# Altium project silovaya_SAUVC26.PrjPcb
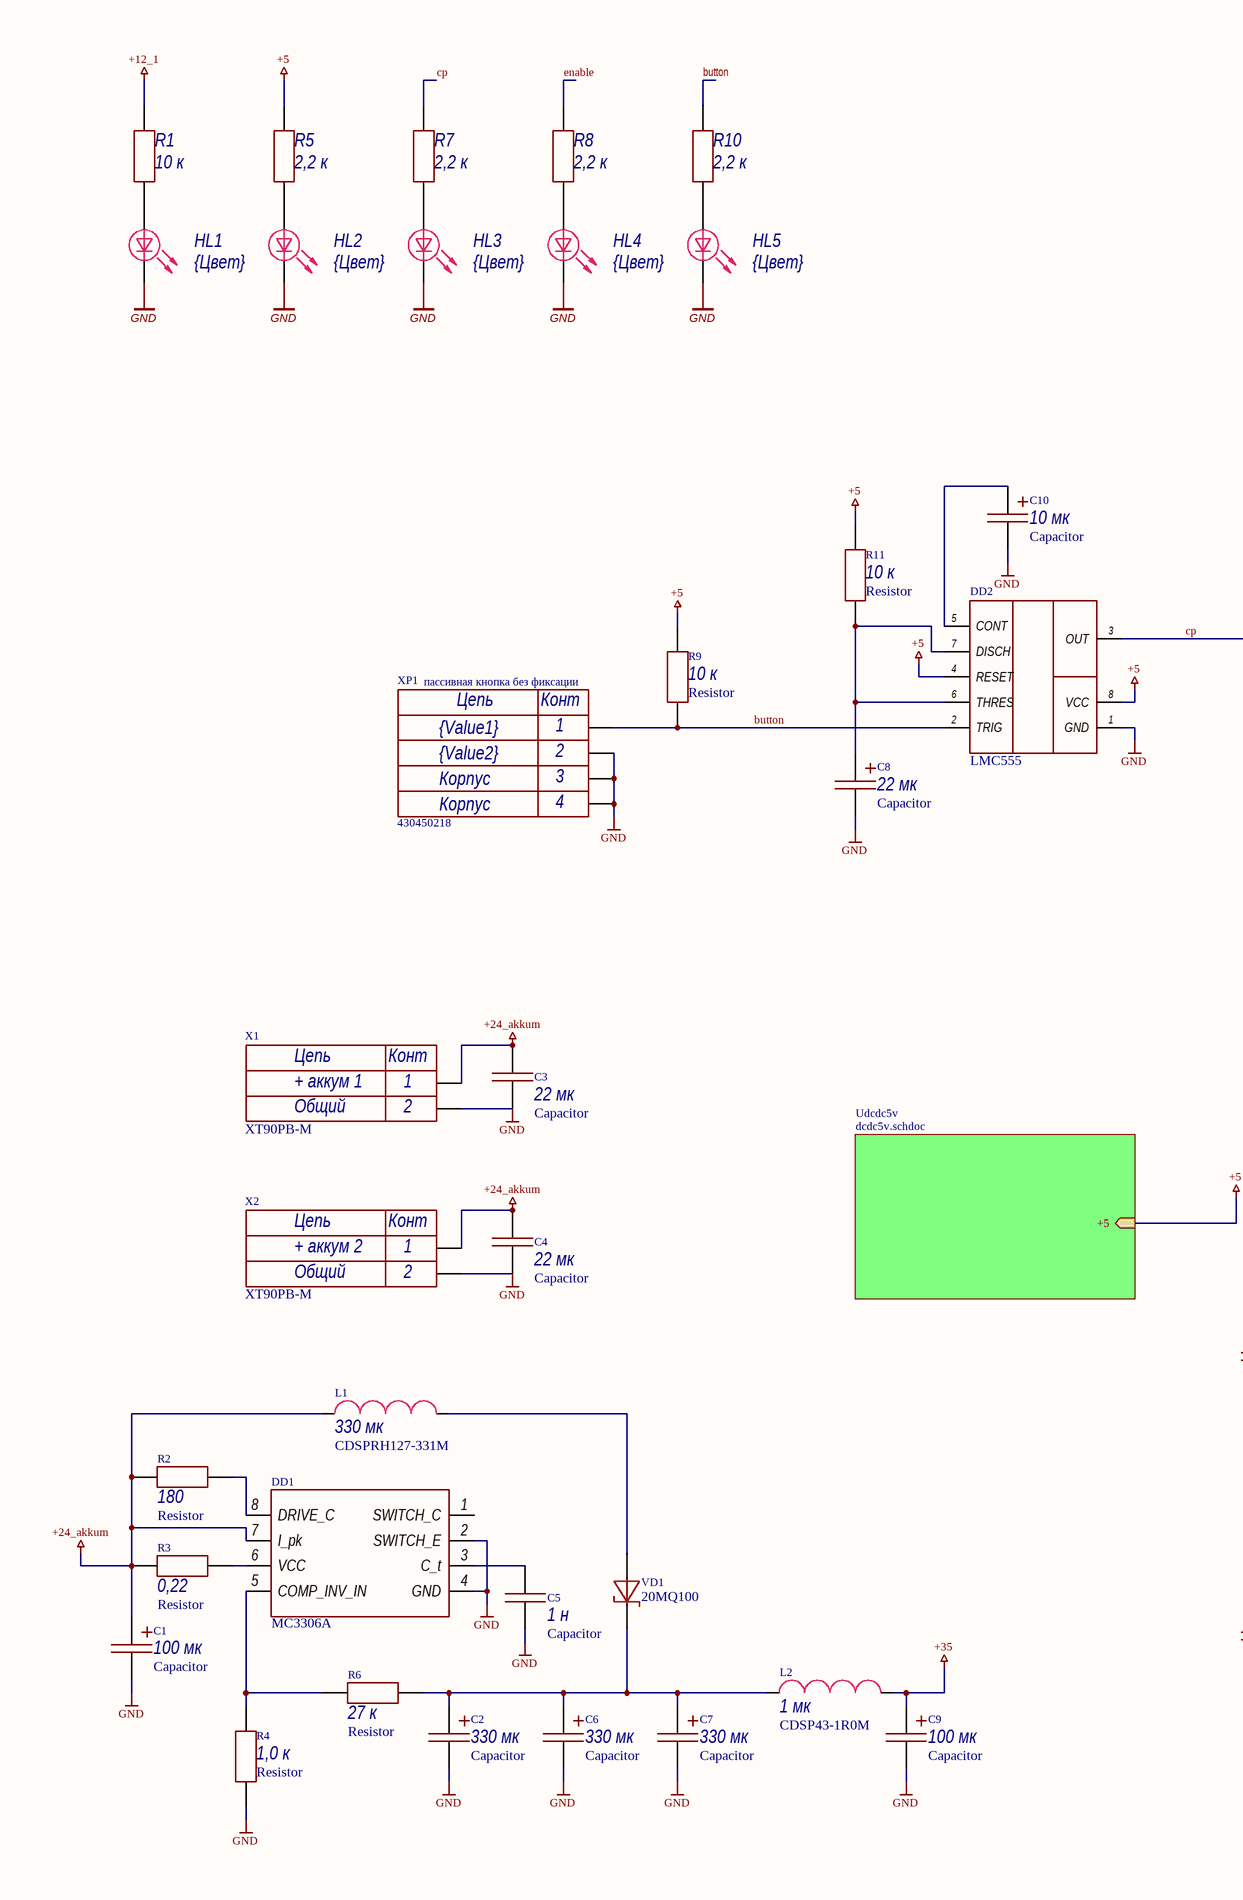
[diagram p0: Sheet1.SchDoc, left]
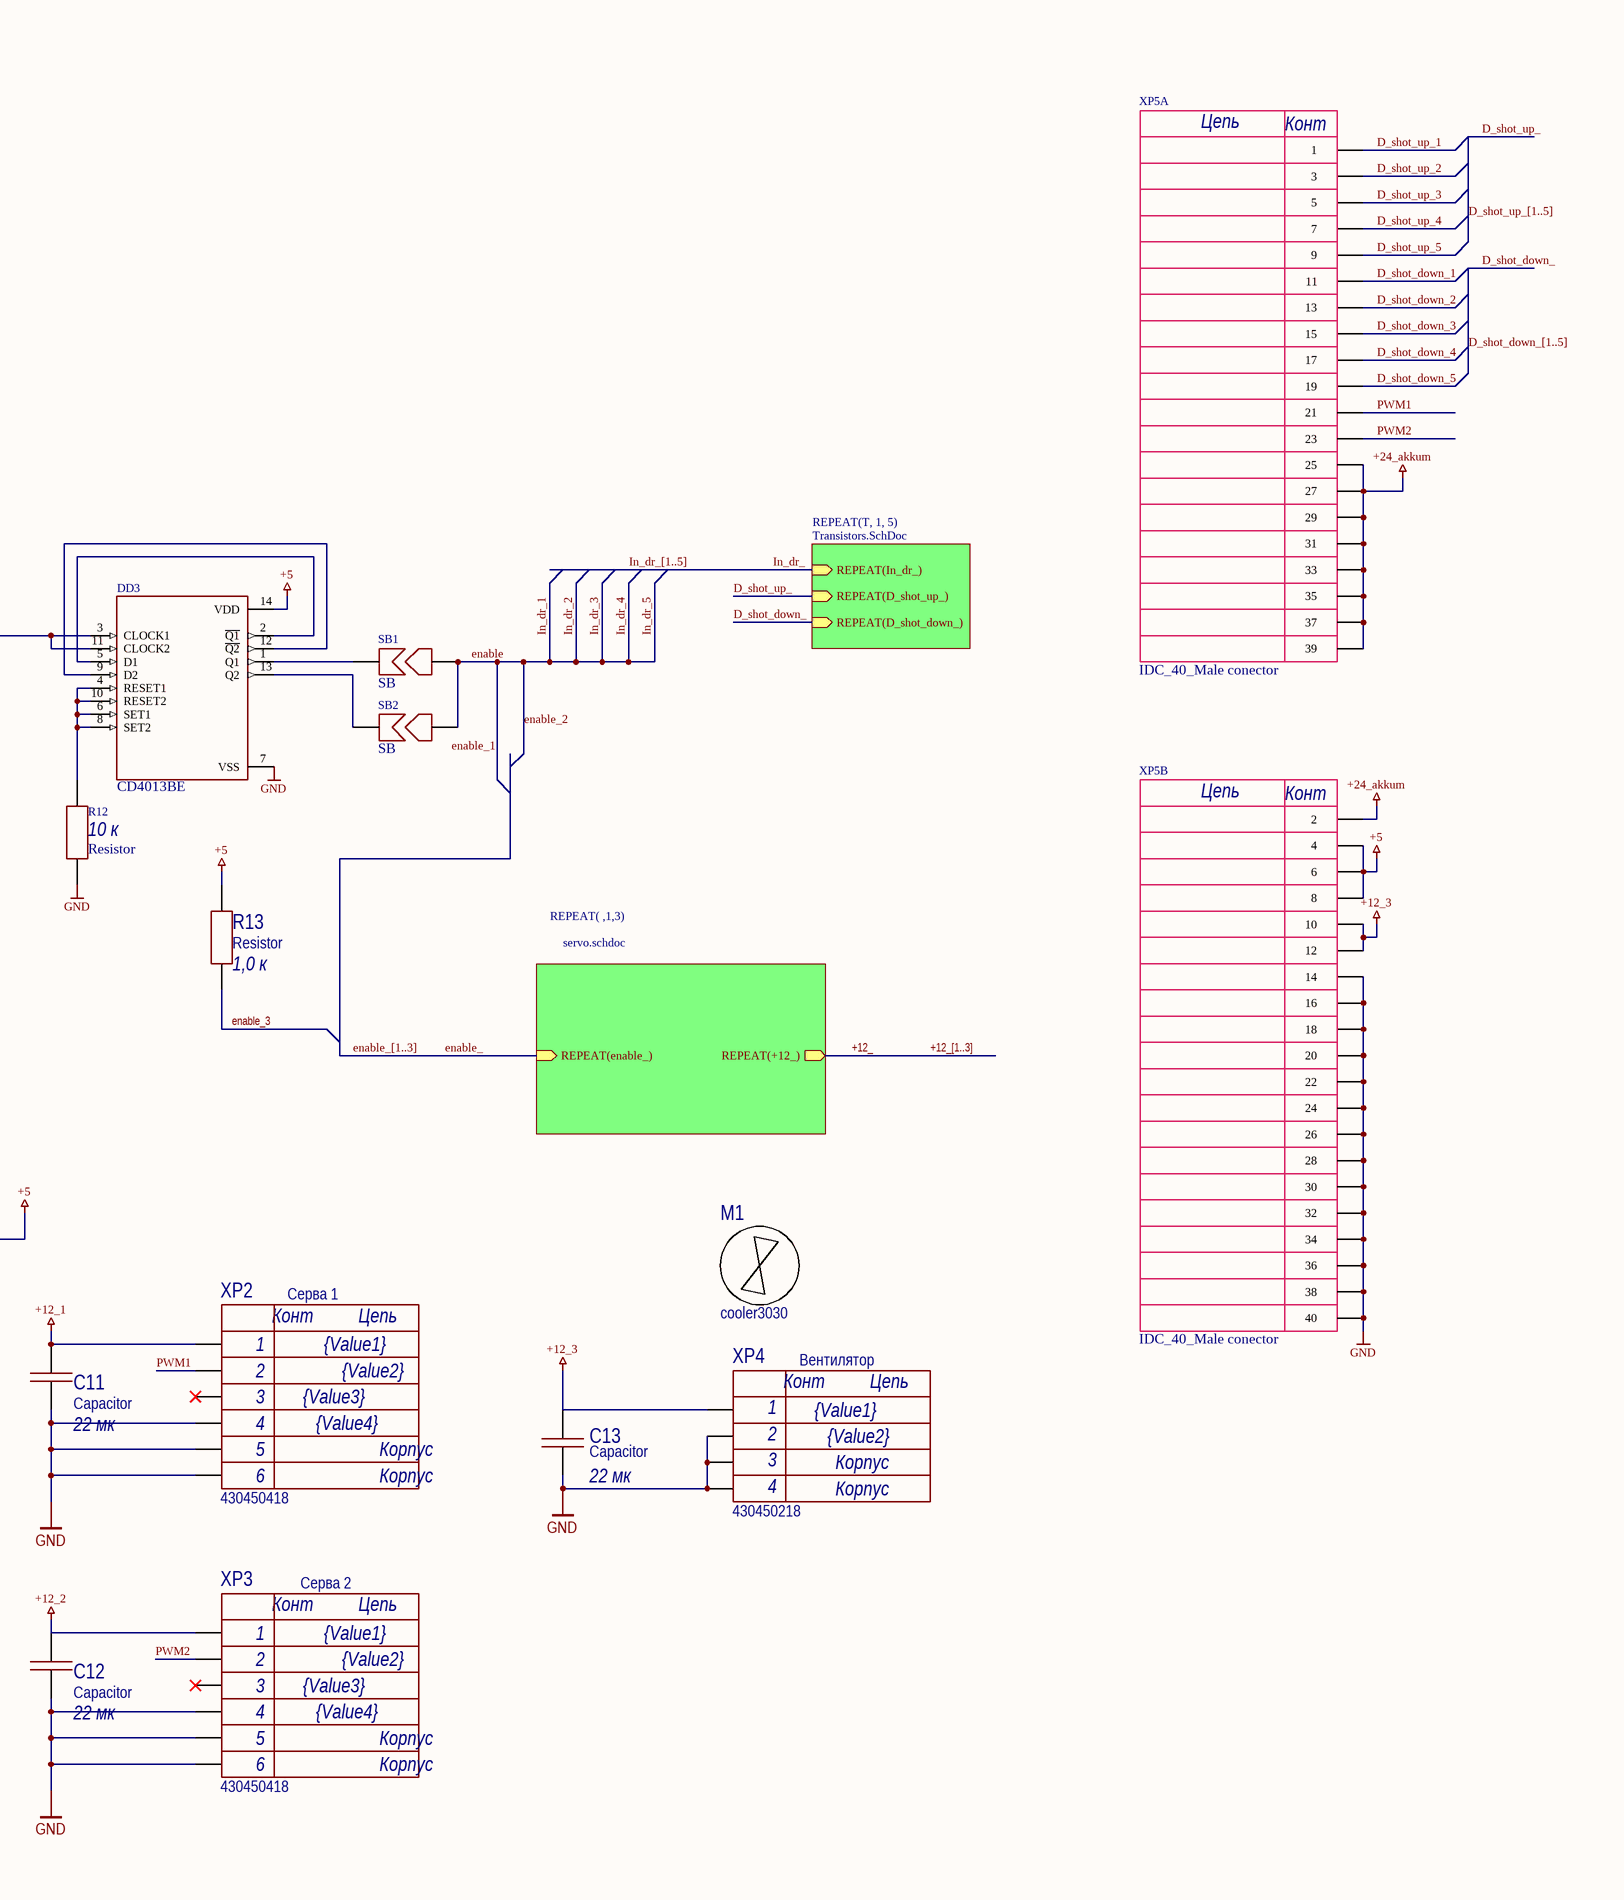
[diagram p1: Sheet1.SchDoc, right]
2 sheets, 92 parts. Net scope: hierarchical (ports join the sheet entries above them; power ports are global).
Board file: PCB1.PcbDoc
Sheets:
  Sheet1.SchDoc
    T1 = Transistors.SchDoc
    T2 = Transistors.SchDoc
    T3 = Transistors.SchDoc
    T4 = Transistors.SchDoc
    T5 = Transistors.SchDoc

## Sheet Sheet1.SchDoc
size A2; SheetNumber: 1; SheetTotal: 4

### Parts
C1  Capacitor  value 100 мк  [ECAP_SMD_6,6x6,6]
C2  Capacitor  value 330 мк  [ECAP_SMD_10,3x10,3]
C3  Capacitor  value 22 мк  [1210C]
C4  Capacitor  value 22 мк  [1210C]
C5  Capacitor  value 1 н  [0603C]
C6  Capacitor  value 330 мк  [ECAP_SMD_10,3x10,3]
C7  Capacitor  value 330 мк  [ECAP_SMD_10,3x10,3]
C8  Capacitor  value 22 мк  [TC_A]
C9  Capacitor  value 100 мк  [ECAP_SMD_6,6x6,6]
C10  Capacitor  value 10 мк  [TC_A]
C11  Capacitor  value 22 мк  [1210C]
C12  Capacitor  value 22 мк  [1210C]
C13  Capacitor  value 22 мк  [1210C]
DD1  MC3306A  [SOIC-8]
DD2  LMC555  [SOIC-8]
DD3  CD4013BE  [DIP14_IN_SOCKET]
HL1  Color: {Цвет}  [0805D]  (hidden comment: LED)
HL2  Color: {Цвет}  [0805D]  (hidden comment: LED)
HL3  Color: {Цвет}  [0805D]  (hidden comment: LED)
HL4  Color: {Цвет}  [0805D]  (hidden comment: LED)
HL5  Color: {Цвет}  [0805D]  (hidden comment: LED)
L1  CDSPRH127-331M  value 330 мк  [12.8x12.8]
L2  CDSP43-1R0M  value 1 мк  [4.5x4_wired]
M1  cooler3030  [cooler3030]
R1  value 10 к  [0603R]  (hidden comment: Resistor)
R2  Resistor  value 180  [0603R]
R3  Resistor  value 0,22  [2512R]
R4  Resistor  value 1,0 к  [0603R]
R5  value 2,2 к  [0603R]  (hidden comment: Resistor)
R6  Resistor  value 27 к  [0603R]
R7  value 2,2 к  [0603R]  (hidden comment: Resistor)
R8  value 2,2 к  [0603R]  (hidden comment: Resistor)
R9  Resistor  value 10 к  [0603R]
R10  value 2,2 к  [0603R]  (hidden comment: Resistor)
R11  Resistor  value 10 к  [0603R]
R12  Resistor  value 10 к  [0603R]
R13  Resistor  value 1,0 к  [0603R]
SB1  SB  [0805SB]
SB2  SB  [0805SB]
VD1  20MQ100  [SMA]
X1  XT90PB-M  Value2: Общий  Value1: + аккум 1  [XT90PB-M]
X2  XT90PB-M  Value2: Общий  Value1: + аккум 2  [XT90PB-M]
XP1  430450218  Value3: Корпус  Value2: {Value2}  Value1: {Value1}  [Molex_430450218]
XP2  430450418  Value1: {Value1}  Value2: {Value2}  Value3: {Value3}  Value4: {Value4}  [MOLEX_430450418]
XP3  430450418  Value1: {Value1}  Value2: {Value2}  Value3: {Value3}  Value4: {Value4}  [MOLEX_430450418]
XP4  430450218  Value3: Корпус  Value2: {Value2}  Value1: {Value1}  [Molex_430450218]
XP5  IDC_40_Male conector  [IDC_40_Male conector]  (parts A,B of 2)

### Sub-sheets
REPEAT( ,1,3) = servo.schdoc (file not in this document): REPEAT(+12_) (out), REPEAT(enable_) (in)
REPEAT(T, 1, 5) = Transistors.SchDoc: REPEAT(In_dr_) (in), REPEAT(D_shot_up_) (in), REPEAT(D_shot_down_) (in)
Udcdc5v = dcdc5v.schdoc (file not in this document): +5 (in)

### Nets
+5: DD2.4(RESET) DD2.8(VCC) DD3.14(VDD) R5.2 R9.2 R11.2 R13.2 XP5.4 XP5.6 XP5.8 ; sheet Udcdc5v/+5
+12_1: C11.2 R1.2 XP2.1
+12_2: C12.2 XP3.1
+12_3: C13.2 XP4.1 XP5.10 XP5.12
+24_akkum: C1.1 C3.2 C4.2 DD1.7(I_pk) L1.1 R2.2 R3.2 X1.P X2.P XP5.2 XP5.25 XP5.27 XP5.29 XP5.31 XP5.33 XP5.35 XP5.37 XP5.39
+35: C9.1 L2.2
GND: C1.2 C2.2 C3.1 C4.1 C5.2 C6.2 C7.2 C8.2 C9.2 C10.2 C11.1 C12.1 C13.1 DD1.2(SWITCH_E) DD1.4(GND) DD2.1(GND) DD3.7(VSS) HL1.2 HL2.2 HL3.2 HL4.2 HL5.2 R4.1 R12.1 X1.N X2.N XP1.0 XP1.2 XP2.0 XP2.4 XP3.0 XP3.4 XP4.0 XP4.2 XP5.14 XP5.16 XP5.18 XP5.20 XP5.22 XP5.24 XP5.26 XP5.28 XP5.30 XP5.32 XP5.34 XP5.36 XP5.38 XP5.40
+12_: sheet REPEAT( ,1,3)/REPEAT(+12_)
button: DD2.2(TRIG) R9.1 R10.2 XP1.1
cp: DD2.3(OUT) DD3.3(CLOCK1) DD3.11(CLOCK2) R7.2
D_shot_down_: sheet REPEAT(T, 1, 5)/REPEAT(D_shot_down_)
D_shot_down_1: XP5.11
D_shot_down_2: XP5.13
D_shot_down_3: XP5.15
D_shot_down_4: XP5.17
D_shot_down_5: XP5.19
D_shot_up_: sheet REPEAT(T, 1, 5)/REPEAT(D_shot_up_)
D_shot_up_1: XP5.1
D_shot_up_2: XP5.3
D_shot_up_3: XP5.5
D_shot_up_4: XP5.7
D_shot_up_5: XP5.9
enable: R8.2 SB1.1 SB2.1  [also labelled enable_1, enable_2, In_dr_1, In_dr_2, In_dr_3, In_dr_4, In_dr_5]
enable_: sheet REPEAT( ,1,3)/REPEAT(enable_)
enable_3: R13.1
In_dr_: sheet REPEAT(T, 1, 5)/REPEAT(In_dr_)
PWM1: XP2.2 XP5.21
PWM2: XP3.2 XP5.23
NetC2_1: C2.1 C6.1 C7.1 L2.1 R6.2 VD1.2
NetC5_1: C5.1 DD1.3(C_t)
NetC8_1: C8.1 DD2.6(THRES) DD2.7(DISCH) R11.1
NetC10_1: C10.1 DD2.5(CONT)
NetDD1_5: DD1.5(COMP_INV_IN) R4.2 R6.1
NetDD1_6: DD1.6(VCC) R3.1
NetDD1_8: DD1.8(DRIVE_C) R2.1
NetDD3_1: DD3.1(Q1) SB1.2
NetDD3_2: DD3.2(~{Q1}) DD3.5(D1)
NetDD3_4: DD3.4(RESET1) DD3.6(SET1) DD3.8(SET2) DD3.10(RESET2) R12.2
NetDD3_9: DD3.9(D2) DD3.12(~{Q2})
NetDD3_13: DD3.13(Q2) SB2.2
NetHL1_1: HL1.1 R1.1
NetHL2_1: HL2.1 R5.1
NetHL3_1: HL3.1 R7.1
NetHL4_1: HL4.1 R8.1
NetHL5_1: HL5.1 R10.1
NetL1_2: L1.2 VD1.1

Not connected (* = marked no-connect by the designer): DD1 1(SWITCH_C); XP2 3*; XP3 3*

### Buses and harness runs
bus +12_[1..3]
bus D_shot_down_[1..5]
bus D_shot_up_[1..5]
bus enable_[1..3]
bus In_dr_[1..5]

### Notes on the sheet
- (near XP1) пассивная кнопка без фиксации
- Серва 1
- Вентилятор
- Серва 2
- (in symbol IDC_40_Male conector, part A) Цепь; Конт
- (in symbol IDC_40_Male conector, part B) Цепь; Конт
- (in symbol Molex_430450218) Цепь; Конт; 3; 4
- (in symbol Molex_430450418) Конт; Цепь; 5; Корпус; 6
- (in symbol XT90PB-M) Цепь; Конт; 1; 2

### Library data of the parts
C1 C9 = JCK1V101: Конденсатор алюминиевый электролитический 100мкФ 35В 20% SMD 6,6x6,6 мм; Tolerance: 20; Voltage (V): 35; Type: SMD Aluminum; Capacity (uF): 100; Part Number: JCK1V101
C2 C6 C7 = JCK1V331: Конденсатор алюминиевый электролитический 1000мкФ 25В 20% Low ESR 1100мА SMD12.5x13.5мм; Tolerance: 20; Voltage (V): 35; Type: SMD Aluminum; Capacity (uF): 1000; Part Number: JCK1V331
C3 C4 = Capacitor_22u_10_25V_X7R_1210C: Конденсатор; Library Path2: Schematic\Capacitor.SchLib; Tolerance: 0,1; Voltage (V): 25; Dielectric: X7R; Capacity (nF): 22000; Part Number: Capacitor_22u_10_25V_X7R_1210C
C5 = Capacitor_1n_10_50V_X7R_0603C: Конденсатор; Library Path2: Schematic\Capacitor.SchLib; Tolerance: 0,1; Voltage (V): 50; Dielectric: X7R; Capacity (nF): 1; Part Number: Capacitor_1n_10_50V_X7R_0603C
C8 = Capacitor_22u_10_50V_TC_A: Танталовый конденсатор; Tolerance: 0,1; Voltage (V): 50; Type: Tantalum; Capacity (uF): 22; Part Number: Capacitor_22u_10_50V_TC_A
C10 = Capacitor_10u_10_50V_TC_A: Танталовый конденсатор; Tolerance: 0,1; Voltage (V): 50; Type: Tantalum; Capacity (uF): 10; Part Number: Capacitor_10u_10_50V_TC_A
C11-C13 = Capacitor_22u_10_25V_X7R_1210C: Конденсатор; Tolerance: 0,1; Voltage (V): 25; Dielectric: X7R; Capacity (nF): 22000; Library Path2: Schematic\Capacitor.SchLib; Part Number: Capacitor_22u_10_25V_X7R_1210C
DD1 = MC3306A: DC-DC понижающий/повышающий преобразователь, вход: 3 - 40 В, выход: 1,25 - 40 В 1,5 А; Part Number: MC3306A
DD2 = LMC555: Таймер интегральный прецизионный КМОП; Part Number: LMC555
DD3 = CD4013BE: Два триггера D-типа; Part Number: CD4013BE
HL1-HL5 = LED: Светодиод; Part Number: LED
L1 = CDSPRH127-331M: Индуктивность на 330 мкГн, номинальный ток 1,79 A; Inductance (μH): 330; Current (A): 1,79; Part Number: CDSPRH127-331M
L2 = CDSP43-1R0M: Индуктивность на 1 мкГн, номинальный ток 4,3 A; Inductance (μH): 1; Current (A): 4,3; Part Number: CDSP43-1R0M
M1 = cooler3030: вентилятор 30*30 с дыркой на плате; Part Number: cooler3030
R1 R9 R11 R12 = Resistor_10k_1_0603: Резистор номиналом 10 кОм и точностью 1%; Power: *; Part Number: Resistor_10k_1_0603; Tolerance: 1%
R2 = Resistor_180_1_0603: Резистор номиналом 180 Ом и точностью 1%; Power: *; Part Number: Resistor_180_1_0603; Tolerance: 1%
R3 = Resistor_0.22_1_2512: Резистор номиналом 0,22 Ом и точностью 1%; Power: *; Part Number: Resistor_0.22_1_2512; Tolerance: 1%
R4 R13 = Resistor_1.0k_1_0603: Резистор номиналом 1,0 кОм и точностью 1%; Power: *; Part Number: Resistor_1.0k_1_0603; Tolerance: 1%
R5 R7 R8 R10 = Resistor_2.2k_1_0603: Резистор номиналом 2,2 кОм и точностью 1%; Power: *; Part Number: Resistor_2.2k_1_0603; Tolerance: 1%
R6 = Resistor_27k_1_0603: Резистор номиналом 27 кОм и точностью 1%; Power: *; Part Number: Resistor_27k_1_0603; Tolerance: 1%
SB1 SB2 = SB: Solder bridge, мост припоя, запаиваемая перемычка, net tie, jumper; Part Number: SB
VD1 = 20MQ100: Диод шоттки на 100 В, ном. ток 2 А; Voltage nominal (V): 100; Current (A): 2; Part Number: 20MQ100
X1 X2 = XT90PB-M: 90 А (60 продолжительно), 2 контакта, прямой отец; Part Number: XT90PB-M
XP1 XP4 = Molex_430450218: Разъем типа провод-плата, 3 мм, 2 контакт(-ов), Штыревой Разъем, Серия Micro-Fit для поверхностного монтажа; Value4: Корпус; Part Number: Molex_430450218
XP2 XP3 = Molex_430450418: Разъем типа провод-плата, 3 мм, 4 контакт(-ов), Штыревой Разъем, для поверностного монтажа; Part Number: Molex_430450418
XP5 = IDC_40_Male conector: IDC 40-пиновый разъём прямая вилка; Part Number: IDC_40_Male conector

## Sheet Transistors.SchDoc
size A3; SheetNumber: 2; SheetTotal: 4
Used 5 times, as channels T1, T2, T3, T4, T5. Parts and nets are listed once, with the designators drawn on the sheet.
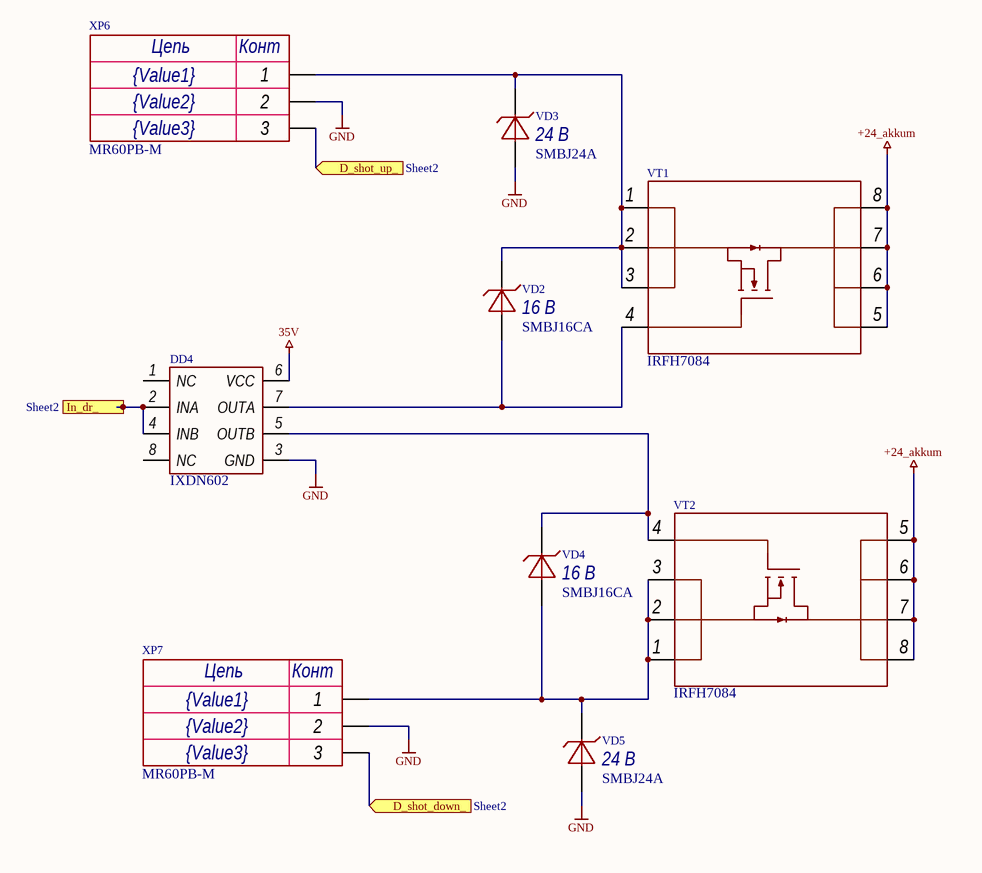
[diagram p2: Transistors.SchDoc]

### Parts
DD4  IXDN602  [SOIC-8]
VD2  SMBJ16CA  value 16 В  [SMB]
VD3  SMBJ24A  value 24 В  [SMB]
VD4  SMBJ16CA  value 16 В  [SMB]
VD5  SMBJ24A  value 24 В  [SMB]
VT1  IRFH7084  [PQFN_5x6]
VT2  IRFH7084  [PQFN_5x6]
XP6  MR60PB-M  Value3: {Value3}  Value2: {Value2}  Value1: {Value1}  [MR60PB-M]
XP7  MR60PB-M  Value3: {Value3}  Value2: {Value2}  Value1: {Value1}  [MR60PB-M]

### Ports
D_shot_down_ (in, see Sheet2), D_shot_up_ (in, see Sheet2), In_dr_ (in, see Sheet2)

### Nets
35V: DD4.6(VCC)
+24_akkum: VT1.5 VT1.6 VT1.7 VT1.8 VT2.5 VT2.6 VT2.7 VT2.8
GND: DD4.3(GND) VD3.1 VD5.1 XP6.2 XP7.2
D_shot_down_: XP7.3 ; port D_shot_down_
D_shot_up_: XP6.3 ; port D_shot_up_
In_dr_: DD4.2(INA) DD4.4(INB) ; port In_dr_
NetDD4_5: DD4.5(OUTB) VD4.2 VT2.4
NetDD4_7: DD4.7(OUTA) VD2.1 VT1.4
NetVD2_2: VD2.2 VD3.2 VT1.1 VT1.2 VT1.3 XP6.1
NetVD4_1: VD4.1 VD5.2 VT2.1 VT2.2 VT2.3 XP7.1

Not connected (* = marked no-connect by the designer): DD4 1(NC) 8(NC)

### Channels
T1: designators end in _T1; ports D_shot_down_=D_shot_down_1 D_shot_up_=D_shot_up_1 In_dr_=enable
T2: designators end in _T2; ports D_shot_down_=D_shot_down_2 D_shot_up_=D_shot_up_2 In_dr_=enable
T3: designators end in _T3; ports D_shot_down_=D_shot_down_3 D_shot_up_=D_shot_up_3 In_dr_=enable
T4: designators end in _T4; ports D_shot_down_=D_shot_down_4 D_shot_up_=D_shot_up_4 In_dr_=enable
T5: designators end in _T5; ports D_shot_down_=D_shot_down_5 D_shot_up_=D_shot_up_5 In_dr_=enable

### Notes on the sheet
- (in symbol MR60PB-M) Цепь; Конт

### Library data of the parts
DD4 = IXDN602: Двухканальный драйвер затвора для mosfet и igbt транзисторов; Part Number: IXDN602
VD2 VD4 = SMBJ16CA: Защитный диод двунаправленный 600Вт 16В; Voltage nominal (V): 16; Power (W): 600; Part Number: SMBJ16CA
VD3 VD5 = SMBJ24A: Защитный диод на 24 В, рассеиваемая мощность 600 Вт; Voltage nominal (V): 24; Power (W): 600; Part Number: SMBJ24A
VT1 VT2 = IRFH7084: N-канальный MOSFET; Напряжение С-И/К-Э: 40 В; Ток макс#: 100 А; Part Number: IRFH7084
XP6 XP7 = MR60PB-M: 60 А (40 продолжительно), 3 контакта, прямой отец; Part Number: MR60PB-M

## Nets that join several sheets
35V: T1 (DD4_T1.6), T2 (DD4_T2.6), T3 (DD4_T3.6), T4 (DD4_T4.6), T5 (DD4_T5.6)
+24_akkum: Sheet1 (18 pins), T1 (8 pins), T2 (8 pins), T3 (8 pins), T4 (8 pins), T5 (8 pins)
GND: Sheet1 (48 pins), T1 (5 pins), T2 (5 pins), T3 (5 pins), T4 (5 pins), T5 (5 pins)
D_shot_down_1: Sheet1 (XP5.11), T1 (XP7_T1.3)
D_shot_down_2: Sheet1 (XP5.13), T2 (XP7_T2.3)
D_shot_down_3: Sheet1 (XP5.15), T3 (XP7_T3.3)
D_shot_down_4: Sheet1 (XP5.17), T4 (XP7_T4.3)
D_shot_down_5: Sheet1 (XP5.19), T5 (XP7_T5.3)
D_shot_up_1: Sheet1 (XP5.1), T1 (XP6_T1.3)
D_shot_up_2: Sheet1 (XP5.3), T2 (XP6_T2.3)
D_shot_up_3: Sheet1 (XP5.5), T3 (XP6_T3.3)
D_shot_up_4: Sheet1 (XP5.7), T4 (XP6_T4.3)
D_shot_up_5: Sheet1 (XP5.9), T5 (XP6_T5.3)
enable: Sheet1 (R8.2 SB1.1 SB2.1), T1 (DD4_T1.2 DD4_T1.4), T2 (DD4_T2.2 DD4_T2.4), T3 (DD4_T3.2 DD4_T3.4), T4 (DD4_T4.2 DD4_T4.4), T5 (DD4_T5.2 DD4_T5.4)